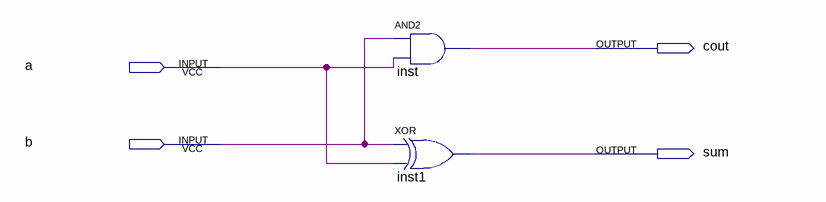
[diagram p0: schematic sheet]
// Quartus schematic adder.bdf as structural Verilog: 2 symbols, 4 pins
module adder (
  input  a,
  input  b,
  output cout,
  output sum
);

  and inst (cout, b, a);
  xor inst1 (sum, b, a);
endmodule
